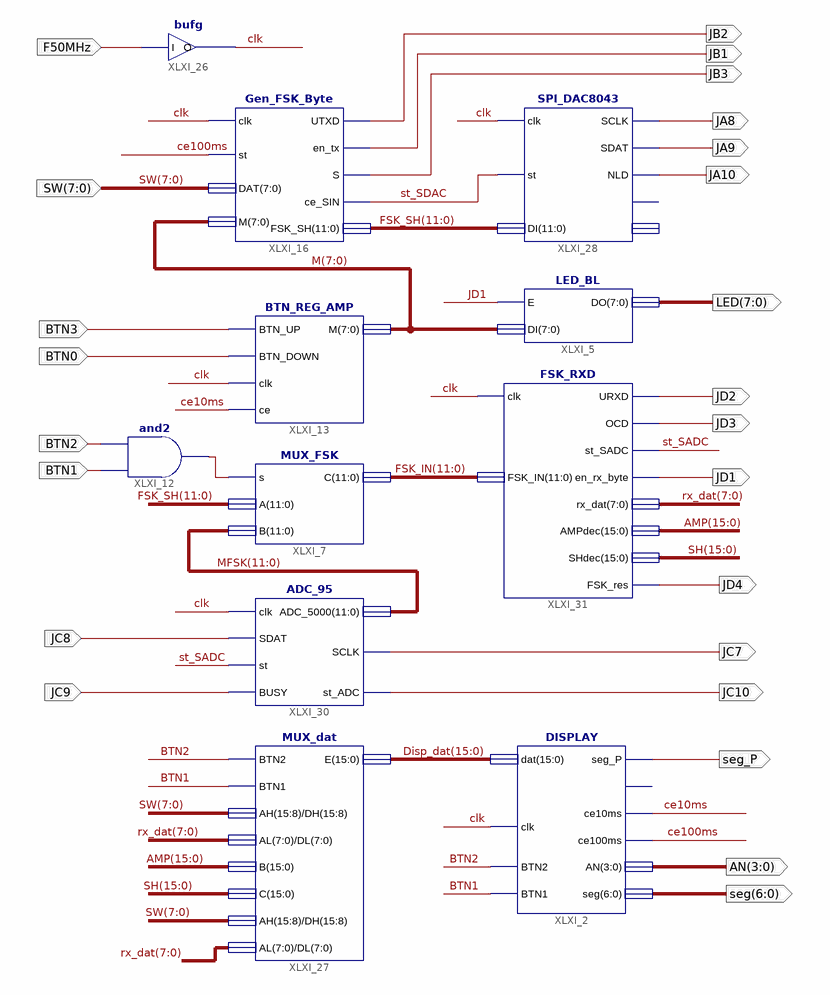
[diagram p0: schematic sheet 1]
// Xilinx ISE schematic S_Sch_Lab414_TS.sch (spartan3e) as structural Verilog: 11 symbols, 24 ports
module S_Sch_Lab414_TS (
  input  BTN3,
  input  BTN0,
  input  BTN1,
  input  BTN2,
  input  JC8,
  input  [7:0] SW,
  input  F50MHz,
  input  JC9,
  output JC10,
  output JC7,
  output [7:0] LED,
  output JD1,
  output JD3,
  output JD2,
  output JB1,
  output JB2,
  output JB3,
  output [3:0] AN,
  output [6:0] seg,
  output seg_P,
  output JA8,
  output JA9,
  output JA10,
  output JD4
);

  wire ce10ms, ce100ms, clk, st_SADC, st_SDAC, XLXN_8;
  wire [7:0] M, rx_dat;
  wire [11:0] FSK_IN, FSK_SH, MFSK;
  wire [15:0] AMP, Disp_dat, SH;

  BTN_REG_AMP XLXI_13 (.BTN_UP(BTN3), .BTN_DOWN(BTN0), .clk(clk), .ce(ce10ms), .M(M));
  and XLXI_12 (XLXN_8, BTN1, BTN2);
  Gen_FSK_Byte XLXI_16 (
    .clk(clk), .st(ce100ms), .DAT(SW), .M(M), .UTXD(JB2), .en_tx(JB1), .S(JB3), .ce_SIN(st_SDAC),
    .FSK_SH(FSK_SH));
  bufg XLXI_26 (.I(F50MHz), .O(clk));
  MUX_FSK XLXI_7 (.s(XLXN_8), .A(FSK_SH), .B(MFSK), .C(FSK_IN));
  LED_BL XLXI_5 (.E(JD1), .DI(M), .DO(LED));
  SPI_DAC8043 XLXI_28 (.clk(clk), .st(st_SDAC), .DI(FSK_SH), .SCLK(JA8), .SDAT(JA9), .NLD(JA10));  // open: ce, cb_bit
  ADC_95 XLXI_30 (.clk(clk), .SDAT(JC8), .st(st_SADC), .BUSY(JC9), .SCLK(JC7), .st_ADC(JC10), .ADC_5000(MFSK));
  DISPLAY XLXI_2 (
    .seg_P(seg_P), .ce10ms(ce10ms), .ce100ms(ce100ms), .AN(AN), .seg(seg), .BTN2(BTN2), .BTN1(BTN1),
    .clk(clk), .dat(Disp_dat));  // open: ce1ms
  MUX_dat XLXI_27 (.BTN2(BTN2), .BTN1(BTN1), .AH(SW), .AL(rx_dat), .B(AMP), .C(SH), .DH(SW), .DL(rx_dat), .E(Disp_dat));
  FSK_RXD XLXI_31 (
    .clk(clk), .FSK_IN(FSK_IN), .URXD(JD2), .OCD(JD3), .st_SADC(st_SADC), .en_rx_byte(JD1), .rx_dat(rx_dat),
    .AMPdec(AMP), .SHdec(SH), .FSK_res(JD4));
endmodule
